# EAGLE design Keg Cop - Pinout (EAGLE 9.5.2)
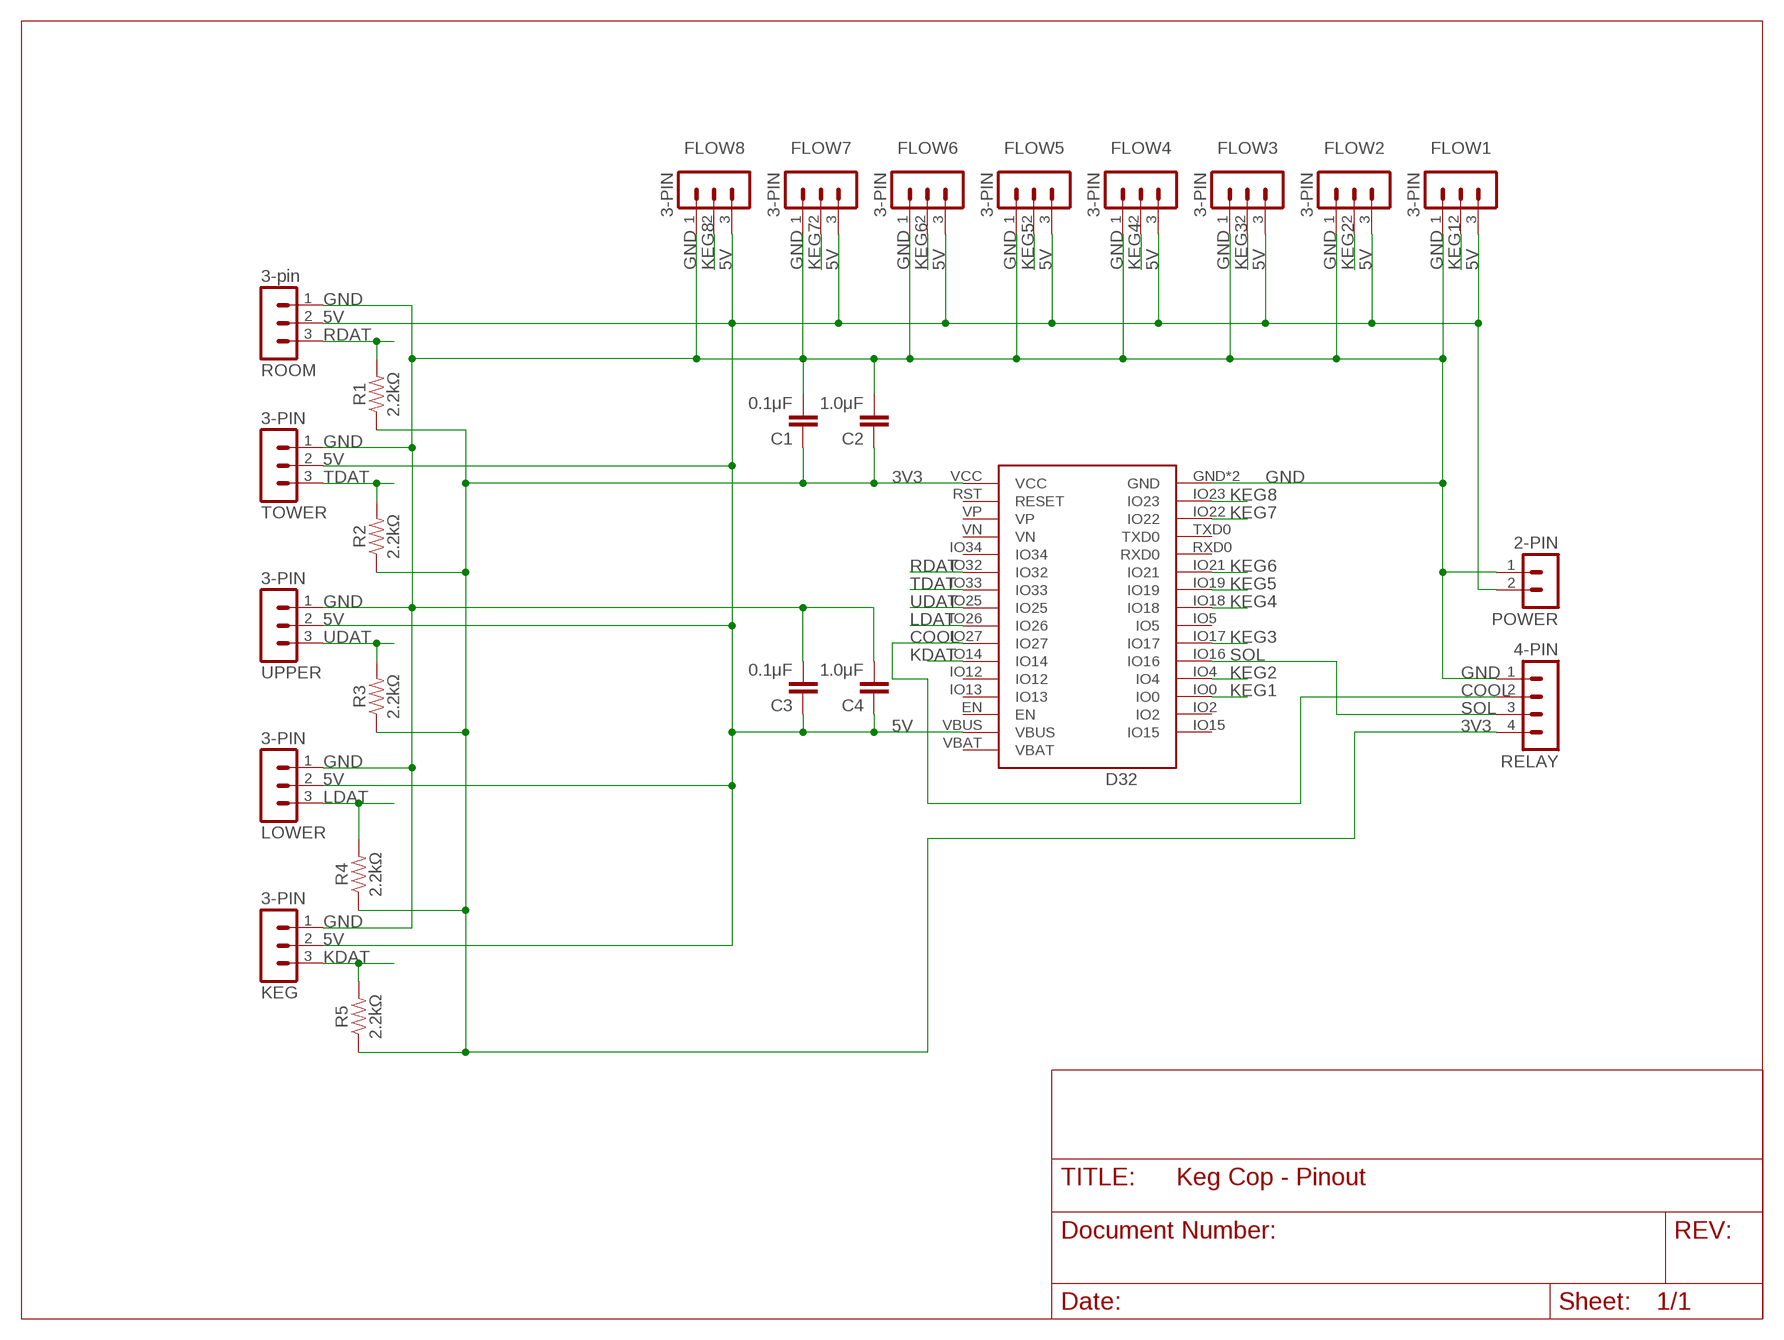
[diagram p0: schematic, sheet 1]

## Parts
C1  0.1μF  CAP_CERAMIC_2.54  [CAP_PTH-2.54]
C2  1.0μF  CAP_CERAMIC_2.54  [CAP_PTH-2.54]
C3  0.1μF  CAP_CERAMIC_2.54  [CAP_PTH-2.54]
C4  1.0μF  CAP_CERAMIC_2.54  [CAP_PTH-2.54]
D32  U1  WEMOS-D32D32_NO_BATT  [D32_NO_BATT]
FLOW1  3-PIN  MA03-1  [MA03-1]
FLOW2  3-PIN  MA03-1  [MA03-1]
FLOW3  3-PIN  MA03-1  [MA03-1]
FLOW4  3-PIN  MA03-1  [MA03-1]
FLOW5  3-PIN  MA03-1  [MA03-1]
FLOW6  3-PIN  MA03-1  [MA03-1]
FLOW7  3-PIN  MA03-1  [MA03-1]
FLOW8  3-PIN  MA03-1  [MA03-1]
KEG  3-PIN  MA03-1  [MA03-1]
LOWER  3-PIN  MA03-1  [MA03-1]
POWER  2-PIN  HDR-2  [HDR-2_VERT]
R1  2.2kΩ  RESISTORAXIAL-0.3  [AXIAL-0.3]
R2  2.2kΩ  RESISTORAXIAL-0.3  [AXIAL-0.3]
R3  2.2kΩ  RESISTORAXIAL-0.3  [AXIAL-0.3]
R4  2.2kΩ  RESISTORAXIAL-0.3  [AXIAL-0.3]
R5  2.2kΩ  RESISTORAXIAL-0.3  [AXIAL-0.3]
RELAY  4-PIN  MA04-1  [MA04-1]
ROOM  3-pin  MA03-1  [MA03-1]
TOWER  3-PIN  MA03-1  [MA03-1]
UPPER  3-PIN  MA03-1  [MA03-1]

## Nets
3V3 [3v]: C1.1 C2.1 D32.VCC R1.P$1 R2.P$1 R3.P$1 R4.P$1 R5.P$1 RELAY.4
5V [5v]: C3.1 C4.1 D32.VBUS FLOW1.3 FLOW2.3 FLOW3.3 FLOW4.3 FLOW5.3 FLOW6.3 FLOW7.3 FLOW8.3 KEG.2 LOWER.2 POWER.2 ROOM.2 TOWER.2 UPPER.2
COOL: D32.IO27 RELAY.2
GND: C1.2 C2.2 C3.2 C4.2 D32.GND D32.GND2(GND) FLOW1.1 FLOW2.1 FLOW3.1 FLOW4.1 FLOW5.1 FLOW6.1 FLOW7.1 FLOW8.1 KEG.1 LOWER.1 POWER.1 RELAY.1 ROOM.1 TOWER.1 UPPER.1
KDAT: D32.IO14 KEG.3 R5.P$2
KEG1: D32.IO0 FLOW1.2
KEG2: D32.IO4 FLOW2.2
KEG3: D32.IO17 FLOW3.2
KEG4: D32.IO18 FLOW4.2
KEG5: D32.IO19 FLOW5.2
KEG6: D32.IO21 FLOW6.2
KEG7: D32.IO22 FLOW7.2
KEG8: D32.IO23 FLOW8.2
LDAT: D32.IO26 LOWER.3 R4.P$2
RDAT: D32.IO32 R1.P$2 ROOM.3
SOL: D32.IO16 RELAY.3
TDAT: D32.IO33 R2.P$2 TOWER.3
UDAT: D32.IO25 R3.P$2 UPPER.3
Unconnected: D32.EN D32.IO2 D32.IO5 D32.IO12 D32.IO13 D32.IO15 D32.IO34 D32.RST(RESET) D32.RXD0 D32.TXD0 D32.VBAT D32.VN D32.VP

## Library data of the parts
C1-C4 = Donnie:CAP_CERAMIC_2.54
D32 = Donnie:WEMOS-D32: D32_REVERSE is a Reverse silkscreen for placing the Wemos D32 on the underside of the board D32_NO-KEEPOUT removes the keepout area beneath the antenna on the D32 and provides a note to avoid components and traces.
FLOW1-FLOW8 KEG LOWER ROOM TOWER UPPER = Donnie:MA03-1: PIN HEADER; OC_FARNELL: unknown; OC_NEWARK: unknown
POWER = Donnie:HDR-2
R1-R5 = SparkFun-Resistors:RESISTOR: Generic Resistor Package
RELAY = Donnie:MA04-1: PIN HEADER; OC_FARNELL: unknown; OC_NEWARK: unknown

## Net classes
0 default: width 0.305 mm, clearance 0.305 mm
1 5v: width 0.406 mm, clearance 0.406 mm
2 3v: width 0.406 mm, clearance 0.406 mm

## Board
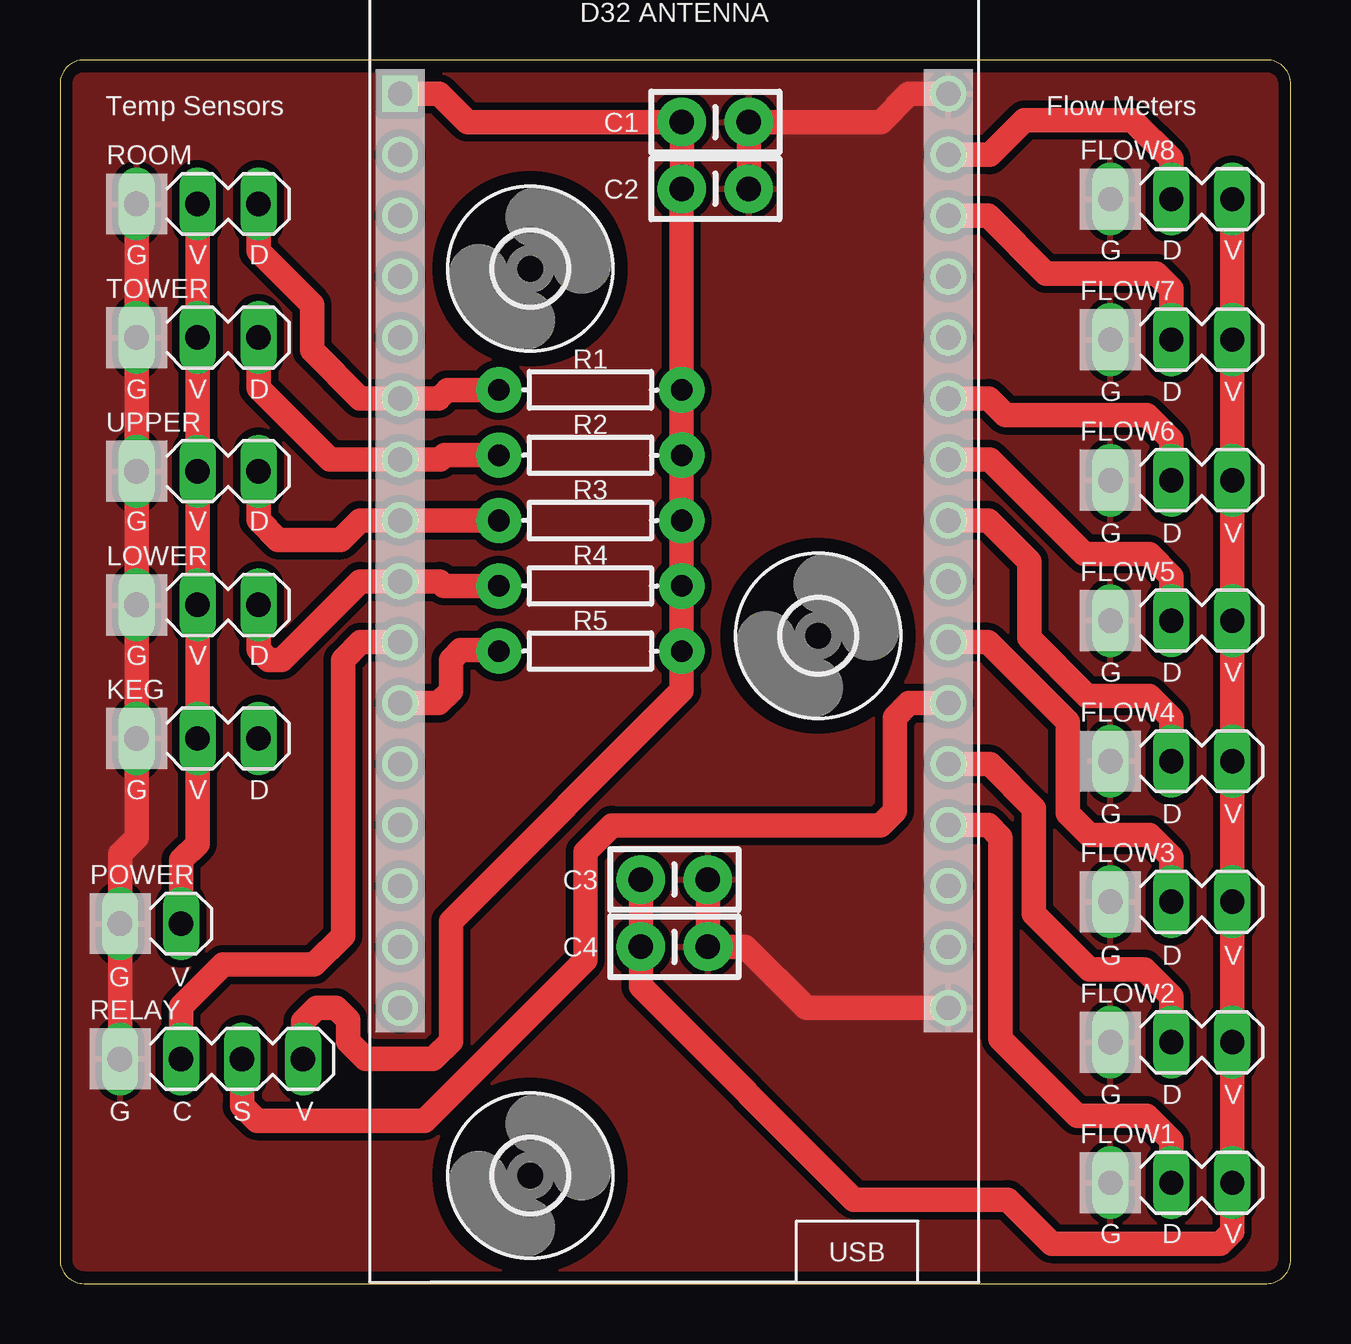
[diagram p1: board, top side]
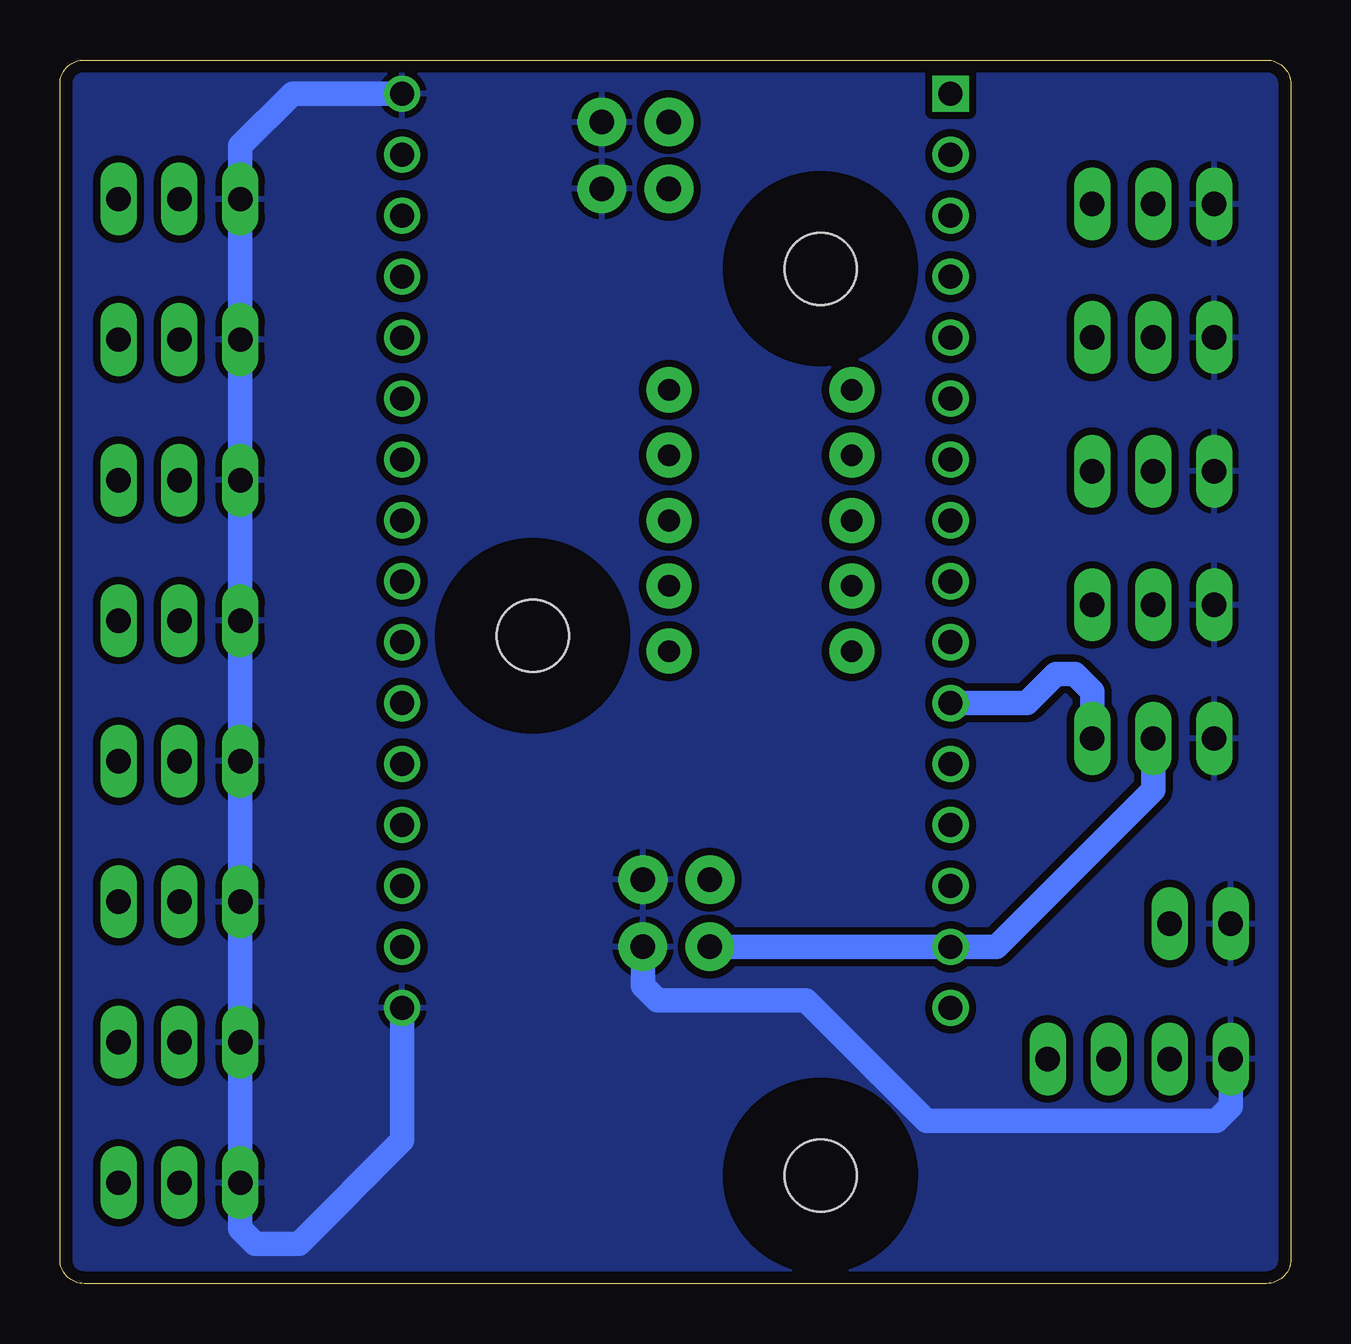
[diagram p2: board, bottom side, seen from below]

Size 51.3 x 51 mm. Coordinates in mm from the lower left corner, seen from the top.
Outline: 0,50 0,1 arc90 1,0 50.3,0 arc90 51.3,1 51.3,50 arc90 50.3,51 1,51 arc90 0,50
Copper layers (1*16): Top 0.035mm / dielectric 1.5mm / Bottom 0.035mm
Design rules "default *": minimum track width 6mil, minimum drill 0.35mm, track to track 6mil, track to pad 6mil, pad to pad 6mil, via to via 6mil, smd to smd 6mil, copper to edge 20mil, drill to drill 6mil, minimum pad ring 10mil, minimum via ring 8mil, stop-mask expansion 4mil, vias tented up to drill 20mil, thermal gap 10mil

### Footprints (pad centres in the part's own frame; a part is rotated, then mirrored left to right if it is on the bottom)
CAP_PTH-2.54 = drill 1.016 pad 2.032: 1 -1.397,0; 2 1.397,0
D32_NO_BATT = drill 1: EN -11.43,-12.7; GND 11.43,20.32; GND2 11.43,-17.78; IO0 11.43,-10.16; IO2 11.43,-12.7; IO4 11.43,-7.62; IO5 11.43,0; IO12 -11.43,-7.62; IO13 -11.43,-10.16; IO14 -11.43,-5.08; IO15 11.43,-15.24; IO16 11.43,-5.08; IO17 11.43,-2.54; IO18 11.43,2.54; IO19 11.43,5.08; IO21 11.43,7.62; IO22 11.43,15.24; IO23 11.43,17.78; IO25 -11.43,2.54; IO26 -11.43,0; IO27 -11.43,-2.54; IO32 -11.43,7.62; IO33 -11.43,5.08; IO34 -11.43,10.16; RST -11.43,17.78; RXD0 11.43,10.16; TXD0 11.43,12.7; VBAT -11.43,-17.78; VBUS -11.43,-15.24; VN -11.43,12.7; VP -11.43,15.24 | drill 1 square: VCC -11.43,20.32
MA03-1 = drill 1.016 long: 1 -2.54,0; 2 0,0; 3 2.54,0
HDR-2_VERT = drill 1.016 long: 1 0,0; 2 2.54,0
AXIAL-0.3 = drill 0.9 pad 1.88: P$1 -3.81,0; P$2 3.81,0
MA04-1 = drill 1.016 long: 1 -3.81,0; 2 -1.27,0; 3 1.27,0; 4 3.81,0
3,0 = hole 3: 0,0

### Placement (x,y rotation side)
C1  27.32,48.41 0 top
C2  27.32,45.63 0 top
C3  25.61,16.84 0 top
C4  25.61,14.04 0 top
D32  25.61,29.27 0 top
FLOW1  46.32,4.2 0 top
FLOW2  46.32,10.06 0 top
FLOW3  46.32,15.91 0 top
FLOW4  46.32,21.77 0 top
FLOW5  46.32,27.63 0 top
FLOW6  46.32,33.49 0 top
FLOW7  46.32,39.34 0 top
FLOW8  46.32,45.2 0 top
KEG  5.73,22.72 0 top
LOWER  5.73,28.29 0 top
POWER  2.51,15 0 top
R1  22.11,37.25 180 top
R2  22.11,34.53 180 top
R3  22.11,31.8 180 top
R4  22.11,29.08 180 top
R5  22.11,26.36 180 top
RELAY  6.32,9.36 0 top
ROOM  5.73,45 0 top
TOWER  5.73,39.43 0 top
U$1  [3,0]  19.6,42.3 0 top
U$2  [3,0]  19.6,4.5 0 top
U$3  [3,0]  31.6,27 0 top
UPPER  5.73,33.86 0 top

### Tracks (layer width: path | path; a pad name or v marks a point on that pad's centre or on a via)
3V3
  Top 0.406: C2.1
  Top 1.016: D32.VCC 15.81,49.59 16.99,48.41 C1.1 C2.1 | RELAY.4 10.13,10.93 10.7,11.5 11.5,11.5 12,11 12,10.1 12.74,9.36 15.56,9.36 16.3,10.1 16.3,15.1 25.92,24.72 R5.P$1 R4.P$1 R3.P$1 R2.P$1 R1.P$1 C2.1
5V
  Top 0.406: C4.1
  Top 1.016: FLOW8.3 FLOW7.3 FLOW6.3 FLOW5.3 FLOW4.3 FLOW3.3 FLOW2.3 FLOW1.3 48.86,2.16 48.36,1.66 41.34,1.66 39.5,3.5 33.1,3.5 24.21,12.39 C4.1 | ROOM.2 TOWER.2 UPPER.2 LOWER.2 KEG.2 5.73,18.33 5.05,17.65 POWER.2 | C3.1 C4.1
  Bottom 0.406: C4.1
  Bottom 1.016: KEG.2 5.73,20.57 12.27,14.03 D32.VBUS C4.1
COOL
  Top 1.016: RELAY.2 5.05,11.55 6.8,13.3 10.6,13.3 11.8,14.5 11.8,26 12.53,26.73 D32.IO27
GND
  Top 1.016: C3.2 C4.2 28.56,14.04 31.11,11.49 D32.GND2 | ROOM.1 TOWER.1 UPPER.1 LOWER.1 KEG.1 3.19,18.59 2.51,17.91 POWER.1 RELAY.1 | C2.2 C1.2 34.21,48.41 35.39,49.59 D32.GND
  Bottom 0.305: FLOW5.1 43.78,27.6 | FLOW4.1 43.78,21.8 | FLOW2.1 43.78,10.4
  Bottom 1.016: C4.2 27.01,12.41 26.4,11.8 20.2,11.8 15.19,6.79 3.1,6.79 2.51,7.38 RELAY.1 | D32.GND2 37.04,5.96 41.34,1.66 43.16,1.66 43.78,2.28 FLOW1.1 43.78,10.4 FLOW3.1 43.78,21.8 43.78,27.6 FLOW6.1 FLOW7.1 FLOW8.1 43.78,47.42 41.61,49.59 D32.GND
  pour Top: 51.6,51.2 51.6,-0.1 -0.2,-0.1 -0.2,51.2
  pour Bottom: -0.2,51.2 51.6,51.2 51.6,-0.1 -0.2,-0.1
KDAT
  Top 0.305: 18.25,26.4 R5.P$2
  Top 1.016: D32.IO14 15.79,24.19 16.3,24.7 16.3,26 16.7,26.4 18.25,26.4
  Bottom 0.305: 14.17,24.2 D32.IO14
  Bottom 1.016: KEG.3 8.27,24.67 9,25.4 9.8,25.4 11,24.2 14.17,24.2
KEG1
  Top 1.016: FLOW1.2 46.32,5.98 45.3,7 42.4,7 39.2,10.2 39.2,18.6 38.69,19.11 D32.IO0
KEG2
  Top 1.016: FLOW2.2 46.32,11.98 45.2,13.1 42.9,13.1 40.6,15.4 40.6,19.8 38.75,21.65 D32.IO4
KEG3
  Top 1.016: FLOW3.2 46.32,17.78 45.4,18.7 42.9,18.7 42,19.6 42,23.4 38.67,26.73 D32.IO17
KEG4
  Top 1.016: FLOW4.2 46.32,23.58 45.4,24.5 42.8,24.5 40.4,26.9 40.4,30.1 38.69,31.81 D32.IO18
KEG5
  Top 1.016: D32.IO19 38.75,34.35 42.7,30.4 45.4,30.4 46.32,29.48 FLOW5.2
KEG6
  Top 1.016: D32.IO21 38.71,36.89 39.4,36.2 45.3,36.2 46.32,35.18 FLOW6.2
KEG7
  Top 1.016: FLOW7.2 46.32,41.48 45.7,42.1 41.1,42.1 38.69,44.51 D32.IO22
KEG8
  Top 1.016: FLOW8.2 46.32,46.88 44.7,48.5 40.2,48.5 38.75,47.05 D32.IO23
LDAT
  Top 1.016: LOWER.3 8.27,26.43 8.7,26 9.24,26 12.51,29.27 D32.IO26 15.83,29.27 16.02,29.08 R4.P$2
RDAT
  Top 1.016: ROOM.3 8.27,43.03 10.5,40.8 10.5,38.9 12.51,36.89 D32.IO32 15.79,36.89 16.15,37.25 R1.P$2
SOL
  Top 1.016: RELAY.3 7.59,7.41 8.21,6.79 15.19,6.79 21.9,13.5 21.9,18 23,19.1 34.2,19.1 34.8,19.7 34.8,23.6 35.39,24.19 D32.IO16
TDAT
  Top 1.016: TOWER.3 8.27,37.33 11.25,34.35 D32.IO33 15.85,34.35 16.03,34.53 R2.P$2
UDAT
  Top 1.016: UPPER.3 8.27,31.83 9.1,31 11.7,31 12.51,31.81 D32.IO25 R3.P$2

### Text on the board
tNames: Temp Sensors | Flow Meters | G | D | V | G | V | D | G | V | D | G | D | V | G | V | D | G | D | V | G | V | D | G | D | V | G | V | D | G | D | V | G | D | V | G | V | G | C | S | V | G | D | V | G | D | V